# Altium schematic sheet Sheet3.SchDoc
size A4
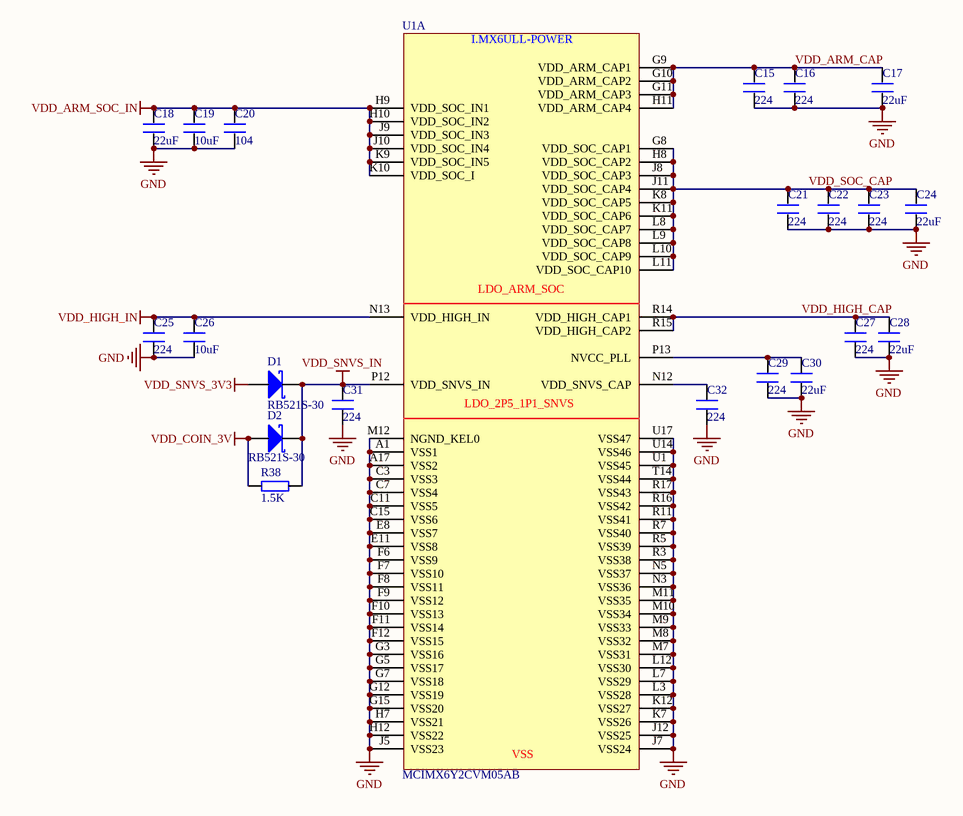
[diagram p0: Sheet3.SchDoc]

## Parts
C15  224  [C 0402]
C16  224  [C 0402]
C17  22uF  [C 0402]
C18  22uF  [C 0402]
C19  10uF  [C 0402]
C20  104  [C 0402]
C21  224  [C 0402]
C22  224  [C 0402]
C23  224  [C 0402]
C24  22uF  [C 0402]
C25  224  [C 0402]
C26  10uF  [C 0402]
C27  224  [C 0402]
C28  22uF  [C 0402]
C29  224  [C 0402]
C30  22uF  [C 0402]
C31  224  [C 0402]
C32  224  [C 0402]
D1  RB521S-30  [SOD-523]
D2  RB521S-30  [SOD-523]
R38  1.5K  [R 0402]
U1  MCIMX6Y2CVM05AB  [BGA289C80P17X17_1400X1400X132]  (part A of 5)

## Nets
GND: C15.1 C16.1 C17.1 C18.1 C19.1 C20.1 C21.1 C22.1 C23.1 C24.1 C25.1 C26.1 C27.1 C28.1 C29.1 C30.1 C31.1 C32.1 U1.A1(VSS1) U1.A17(VSS2) U1.C3(VSS3) U1.C7(VSS4) U1.C11(VSS5) U1.C15(VSS6) U1.E8(VSS7) U1.E11(VSS8) U1.F6(VSS9) U1.F7(VSS10) U1.F8(VSS11) U1.F9(VSS12) U1.F10(VSS13) U1.F11(VSS14) U1.F12(VSS15) U1.G3(VSS16) U1.G5(VSS17) U1.G7(VSS18) U1.G12(VSS19) U1.G15(VSS20) U1.H7(VSS21) U1.H12(VSS22) U1.J5(VSS23) U1.J7(VSS24) U1.J12(VSS25) U1.K7(VSS26) U1.K12(VSS27) U1.L3(VSS28) U1.L7(VSS29) U1.L12(VSS30) U1.M7(VSS31) U1.M8(VSS32) U1.M9(VSS33) U1.M10(VSS34) U1.M11(VSS35) U1.M12(NGND_KEL0) U1.N3(VSS36) U1.N5(VSS37) U1.R3(VSS38) U1.R5(VSS39) U1.R7(VSS40) U1.R11(VSS41) U1.R16(VSS42) U1.R17(VSS43) U1.T14(VSS44) U1.U1(VSS45) U1.U14(VSS46) U1.U17(VSS47)
VDD_ARM_SOC_IN: C18.2 C19.2 C20.2 U1.H9(VDD_SOC_IN1) U1.H10(VDD_SOC_IN2) U1.J9(VDD_SOC_IN3) U1.J10(VDD_SOC_IN4) U1.K9(VDD_SOC_IN5) U1.K10(VDD_SOC_I)
VDD_COIN_3V: D2.1(A) R38.1
VDD_HIGH_IN: C25.2 C26.2 U1.N13(VDD_HIGH_IN)
VDD_SNVS_3V3: D1.1(A)
VDD_SNVS_IN: C31.2 D1.2(C) D2.2(C) R38.2 U1.P12(VDD_SNVS_IN)
VDD_ARM_CAP: C15.2 C16.2 C17.2 U1.G9(VDD_ARM_CAP1) U1.G10(VDD_ARM_CAP2) U1.G11(VDD_ARM_CAP3) U1.H11(VDD_ARM_CAP4)
VDD_HIGH_CAP: C27.2 C28.2 U1.R14(VDD_HIGH_CAP1) U1.R15(VDD_HIGH_CAP2)
VDD_SOC_CAP: C21.2 C22.2 C23.2 C24.2 U1.G8(VDD_SOC_CAP1) U1.H8(VDD_SOC_CAP2) U1.J8(VDD_SOC_CAP3) U1.J11(VDD_SOC_CAP4) U1.K8(VDD_SOC_CAP5) U1.K11(VDD_SOC_CAP6) U1.L8(VDD_SOC_CAP7) U1.L9(VDD_SOC_CAP8) U1.L10(VDD_SOC_CAP9) U1.L11(VDD_SOC_CAP10)
NetC29_2: C29.2 C30.2 U1.P13(NVCC_PLL)
NetC32_2: C32.2 U1.N12(VDD_SNVS_CAP)

## Notes on the sheet
- (in symbol MCIMX6Y2CVM05AB, part A) I.MX6ULL-POWER; LDO_ARM_SOC; LDO_2P5_1P1_SNVS; VSS

## Library data of the parts
C15-C32 = C
R38 = R